# EAGLE design HRsensorFlex (EAGLE 8.6.0)
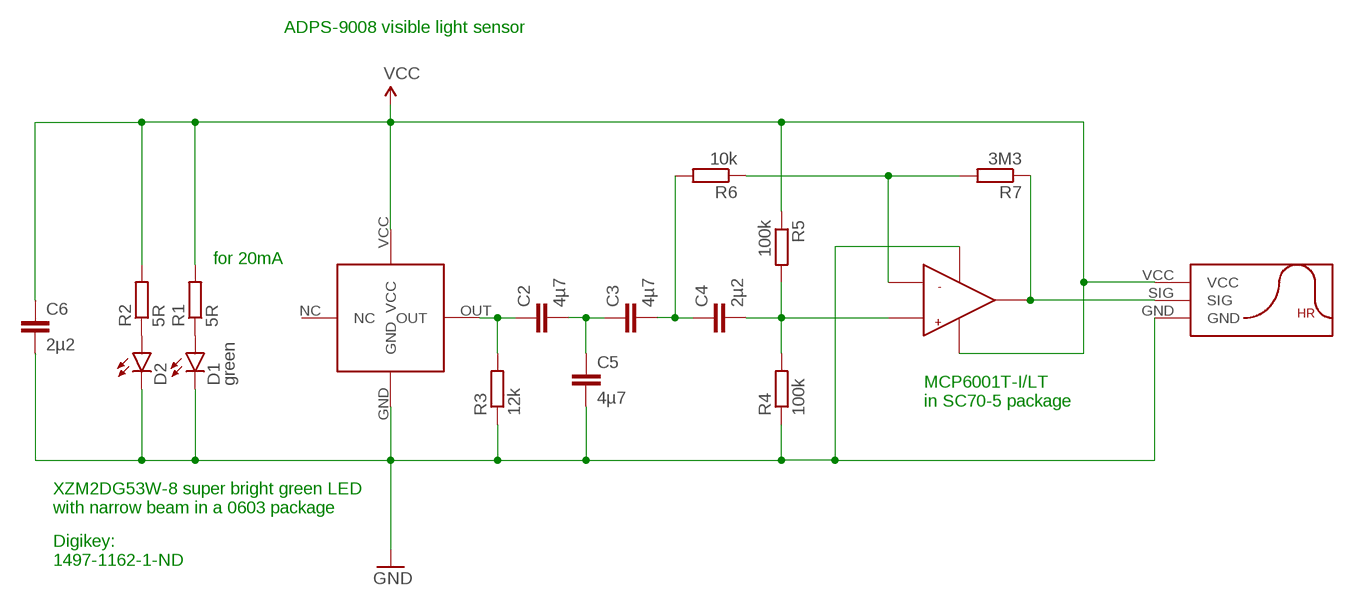
[diagram p0: schematic, sheet 1]

## Parts
C2  4µ7  C-EUC0402  [C0402]
C3  4µ7  C-EUC0402  [C0402]
C4  2µ2  C-EUC0402  [C0402]
C5  4µ7  C-EUC0402  [C0402]
C6  2µ2  C-EUC0402  [C0402]
D1  green  LED0603  [LED-0603]
D2  LED0603  [LED-0603]
R1  5R  R-EU_R0402  [R0402]
R2  5R  R-EU_R0402  [R0402]
R3  12k  R-EU_R0402  [R0402]
R4  100k  R-EU_R0402  [R0402]
R5  100k  R-EU_R0402  [R0402]
R6  10k  R-EU_R0402  [R0402]
R7  3M3  R-EU_R0402  [R0402]
U$1  MCP6001  [SC70-5L]
U$2  APDS-9008  [APDS9008]
U$3  HR_PADS  [HR_PADS]

## Nets
GND: C5.2 C6.2 D1.C D2.C R3.1 R4.1 U$1.2(VSS) U$2.GND U$3.GND
IN+: C4.2 R4.2 R5.2 U$1.3(+)
IN-: R6.1 R7.2 U$1.4(-)
N$1: D1.A R1.1
N$2: D2.A R2.1
N$3: C3.2 C4.1 R6.2
N$12: C2.1 R3.2 U$2.OUT
N$13: C2.2 C3.1 C5.1
OUT: R7.1 U$1.1(OUT) U$3.SIG
VCC: C6.1 R1.2 R2.2 R5.1 U$1.5(VDD) U$2.VCC U$3.VCC
Unconnected: U$2.NC

## Notes on the sheet
- ADPS-9008 visible light sensor
- for 20mA
- MCP6001T-I/LT
  in SC70-5 package
- XZM2DG53W-8 super bright green LED 
  with narrow beam in a 0603 package
- Digikey: 
  1497-1162-1-ND

## Library data of the parts
C2-C6 = rcl:C-EU: CAPACITOR, European symbol
D1 D2 = SparkFun-LED:LED: LEDs Standard schematic elements and footprints for 5mm, 3mm, 1206, and 0603 sized LEDs. 5mm - Spark Fun Electronics SKU : COM-00529 (and others)
R1-R7 = rcl:R-EU_: RESISTOR, European symbol
U$1 = mcp6001:MCP6001
U$2 = APDS.9008:APDS-9008
U$3 = HR_pads:HR_PADS

## Board
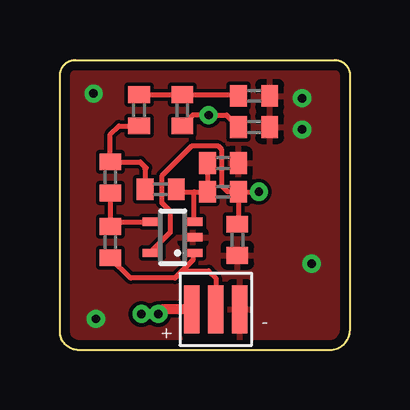
[diagram p1: board, top side]
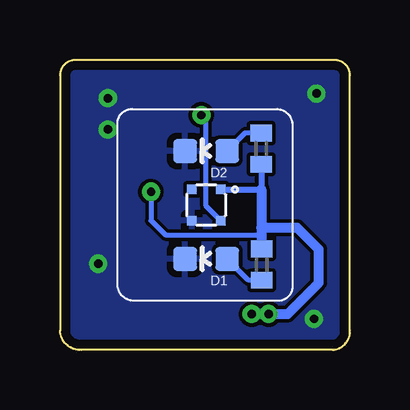
[diagram p2: board, bottom side, seen from below]

Size 12.1 x 12.1 mm. Coordinates in mm from the lower left corner, seen from the top.
Outline: 0.73,0 arc-90 0,0.82 0,11.45 arc-90 0.65,12.1 11.46,12.1 arc-90 12.1,11.45 12.1,0.8 arc-90 11.2,0 0.73,0
Copper layers (1*16): Top 0.035mm / dielectric 1.5mm / Bottom 0.035mm
Design rules "default *": minimum track width 6mil, minimum drill 0.35mm, track to track 6mil, track to pad 6mil, pad to pad 6mil, via to via 6mil, smd to smd 6mil, copper to edge 15mil, drill to drill 6mil, minimum pad ring 10mil, minimum via ring 8mil, stop-mask expansion 4mil, vias tented up to drill 20mil, thermal gap 10mil

### Footprints (pad centres in the part's own frame; a part is rotated, then mirrored left to right if it is on the bottom)
C0402 = smd 0.7 x 0.9: 1 -0.65,0; 2 0.65,0
LED-0603 = smd 1 x 1: A 0,-0.877; C 0,0.877
R0402 = smd 0.7 x 0.9: 1 -0.65,0; 2 0.65,0
SC70-5L = smd 0.35 x 0.8: 1 -0.65,-0.85; 2 0,-0.85; 3 0.65,-0.85; 4 0.65,0.85; 5 -0.65,0.85
APDS9008 = smd 0.4 x 0.4: GND 1.2,1.3; NC 1.2,0; OUT 0,1.3; VCC 0,0
HR_PADS = smd 2 x 0.635: GND 0,-1; SIG 0,0; VCC 0,1

### Placement (x,y rotation side)
C2  5.1,10 90 top
C3  3.3,10 270 top
C4  4.2,6.7 0 top
C5  8.1,10.6 0 top
C6  7.4,4.6 270 top
D1  6,3.8 90 bottom
D2  6,8.3 90 bottom
R1  3.68,3.56 90 bottom
R2  3.7,8.4 270 bottom
R3  8.1,9.3 180 top
R4  6.8,7.8 180 top
R5  6.8,6.6 180 top
R6  2.1,7.2 90 top
R7  2.1,4.5 90 top
U$1  4.7,4.7 90 top
U$2  5.4,6.7 180 bottom
U$3  6.5,1.7 90 top

### Tracks (layer width: path | path; a pad name or v marks a point on that pad's centre or on a via)
GND  (via drill 0.35)
  other vias: 10.5,3.6 10.1,9.2 10.1,10.5 1.4,10.7 1.5,1.3
  pour Top: -0.7,13 -0.7,-0.7 13,-0.7 13,13
  pour Bottom: -1.4,5.5 -1.4,-1.5 13.7,-1.5 13.7,13.7 13.3,13.7 -1.4,13.7
IN+
  Top 0.203: R4.2 R5.2 5.6,6.6 | C4.2 4.95,6.6 5.6,6.6 | U$1.3 5.6,5.4 5.6,6.6
IN-
  Top 0.203: R6.1 R7.2 2.3,5.35 U$1.4
N$1
  Bottom 0.203: R1.1 4.23,2.91 D1.A
N$2
  Bottom 0.203: R2.1 4.37,9.05 D2.A
N$3
  Top 0.203: C3.2 2.45,9.35 2.1,9 R6.2 3.35,7.85 3.6,7.6 3.55,7.55 C4.1
N$12  (via drill 0.35)
  Top 0.203: C2.1 5.55,9.8 v6.2,9.8 6.95,9.8 R3.2
  Bottom 0.203: U$2.OUT 6,6 6,9.6 v6.2,9.8
N$13
  Top 0.203: C3.1 C2.2 7.4,10.65 C5.1
OUT
  Top 0.203: R7.1 2.95,3 4.8,3 5.1,3.3 | U$1.1 5.55,3.75 5.1,3.3 | 5.1,3.3 6.2,3.3 6.5,3 U$3.SIG
VCC  (via drill 0.35)
  Top 0.203: R5.1 7.45,5.3 C6.1 | R5.1 v8.3,6.6 | R5.1 7,6.6 6.76,6.85 6.76,8.36 6.61,8.5 5.5,8.5 4.25,7.26 4.25,6.15 4.6,5.79 4.6,4.9 3.85,4.15 U$1.5
  Top 0.406: U$3.VCC 4.3,1.7 v4.1,1.5
  Bottom 0.203: v8.3,6.6 8.3,5.4 7.7,4.8 3.7,4.8
  Bottom 0.254: R2.2 3.7,6.7 U$2.VCC | 3.7,4.23 R1.2
  Bottom 0.406: 3.7,6.7 3.7,5.1 | 3.7,5.1 3.7,4.8 3.7,4.23 | 3.7,5.1 2.2,5.1 1.3,4.2 1.3,2.8 2.6,1.5 v4.1,1.5 v3.4,1.5

### Text on the board
tPlace: + | -